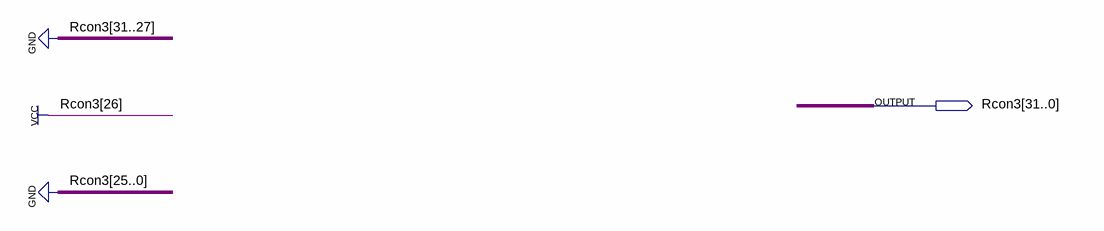
[diagram p0: schematic sheet]
// Quartus schematic Rcon3.bdf as structural Verilog: 0 symbols, 1 pins
module Rcon3 (
  output [31:0] Rcon3
);


  assign Rcon3 = 32'b00000100000000000000000000000000;
endmodule
